# EAGLE schematic EMSBUS (EAGLE 9.6.2)
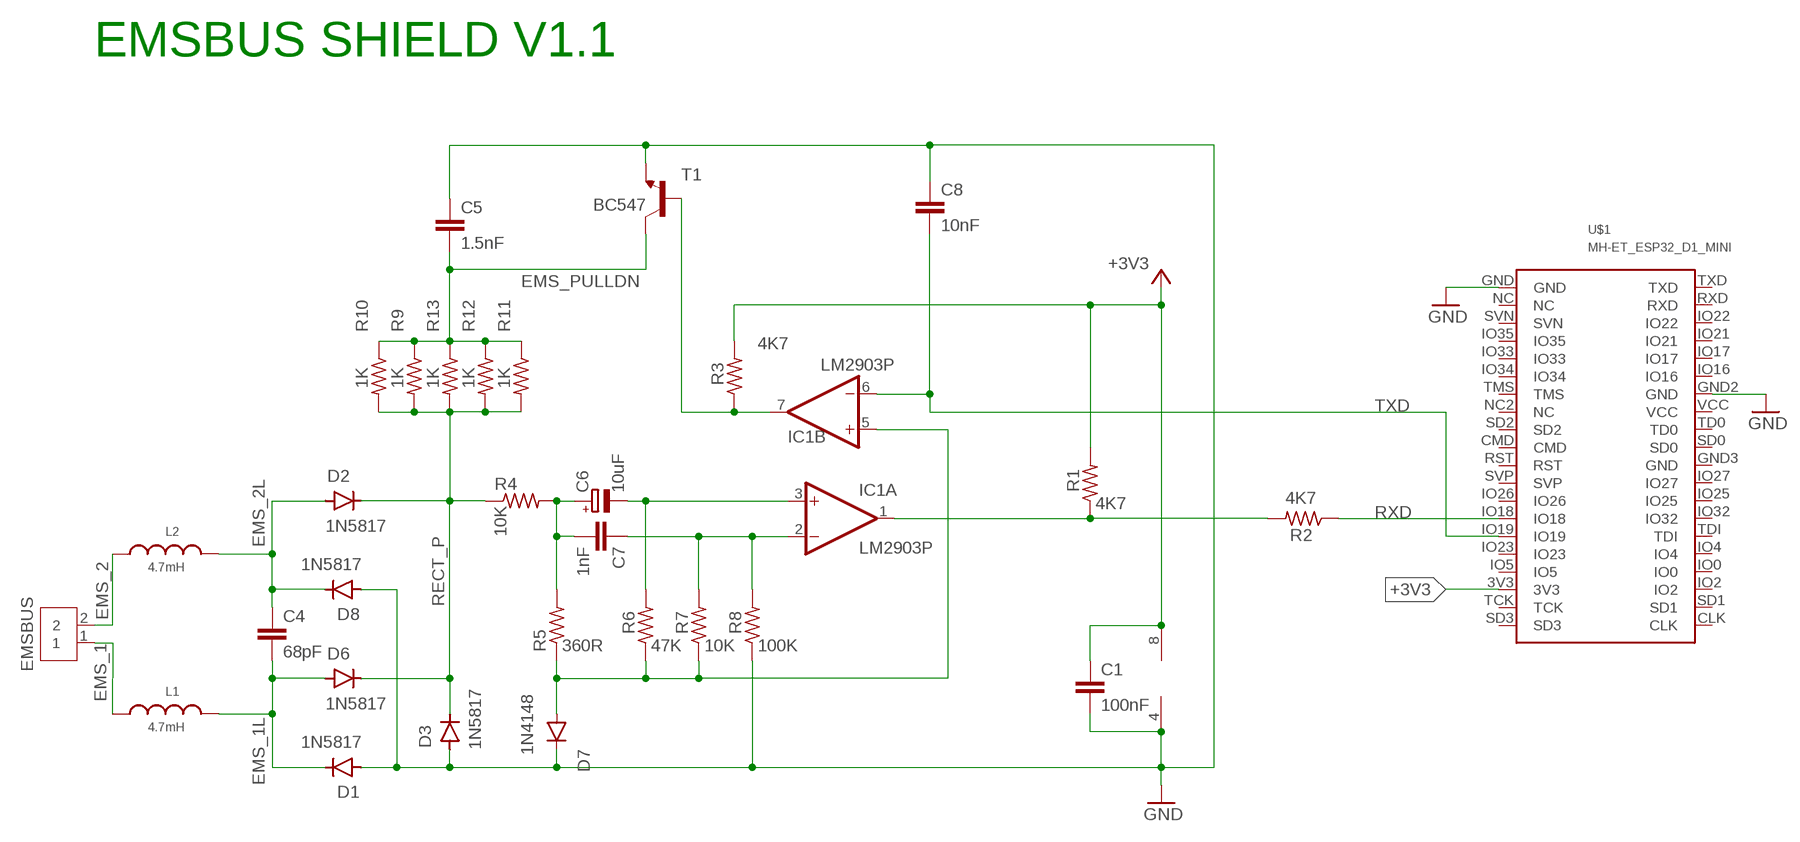
[diagram p0: schematic, sheet 1]

## Parts
C1  100nF  22PF-PTH-2.54MM-200V-5%  [CAP-PTH-2.54]
C4  68pF  22PF-PTH-2.54MM-200V-5%  [CAP-PTH-2.54]
C5  1.5nF  22PF-PTH-2.54MM-200V-5%  [CAP-PTH-2.54]
C6  10uF  CPOL-EUE5-8.5  [E5-8,5]
C7  1nF  22PF-PTH-2.54MM-200V-5%  [CAP-PTH-2.54]
C8  10nF  22PF-PTH-2.54MM-200V-5%  [CAP-PTH-2.54]
D1  1N5817  1N4007  [DO-41]
D2  1N5817  1N4007  [DO-41]
D3  1N5817  1N4007  [DO-41]
D6  1N5817  1N4007  [DO-41]
D7  1N4148  DIODE1N4148  [DIODE-1N4148]
D8  1N5817  1N4007  [DO-41]
EMSBUS  2828XX-2282837-2  [TERMBLK_508-2N]
IC1  LM2903P  TLC393P  [DIL08]
L1  4.7mH  WE-FAMI_744750230030  [WE-FAMI_8010_744750230030]
L2  4.7mH  WE-FAMI_744750230030  [WE-FAMI_8010_744750230030]
R1  4K7  R-US_0204/7  [0204/7]
R2  4K7  R-US_0204/7  [0204/7]
R3  4K7  R-US_0204/7  [0204/7]
R4  10K  R-US_0204/7  [0204/7]
R5  360R  R-US_0204/7  [0204/7]
R6  47K  R-US_0204/7  [0204/7]
R7  10K  R-US_0204/7  [0204/7]
R8  100K  R-US_0204/7  [0204/7]
R9  1K  R-US_0204/7  [0204/7]
R10  1K  R-US_0204/7  [0204/7]
R11  1K  R-US_0204/7  [0204/7]
R12  1K  R-US_0204/7  [0204/7]
R13  1K  R-US_0204/7  [0204/7]
T1  BC547  [TO92]
U$1  MH-ET_ESP32_D1_MINI  [MH-ET_ESP32_D1_MINI]

## Nets
+3V3 [PWR]: C1.1 IC1.8(P:V+) R1.2 R3.2 U$1.3V3
EMS_1 [PWR]: EMSBUS.1 L1.1
EMS_1L [PWR]: C4.2 D1.C D6.A L1.2
EMS_2 [PWR]: EMSBUS.2 L2.1
EMS_2L [PWR]: C4.1 D2.A D8.C L2.2
EMS_PULLDN [PWR]: C5.2 R9.1 R10.1 R11.1 R12.1 R13.1 T1.3(C)
GND [PWR]: C1.2 C5.1 C8.1 D1.A D3.A D7.C D8.A IC1.4(P:V-) R8.1 T1.1(E) U$1.GND U$1.GND2(GND)
N$1: IC1.7(B:OUT) R3.1 T1.2(B)
N$3: IC1.1(A:OUT) R1.1 R2.2
N$5: D7.A IC1.5(B:+IN) R5.1 R6.1 R7.1
N$6: C6.+ C7.2 R4.2 R5.2
N$7: C7.1 IC1.2(A:-IN) R7.2 R8.2
N$8: C6.- IC1.3(A:+IN) R6.2
RECT_P [PWR]: D2.C D3.C D6.C R4.1 R9.2 R10.2 R11.2 R12.2 R13.2
RXD: R2.1 U$1.IO18
TXD: C8.2 IC1.6(B:-IN) U$1.IO19
Unconnected: U$1.CLK U$1.CMD U$1.GND3(GND) U$1.IO0 U$1.IO2 U$1.IO4 U$1.IO5 U$1.IO16 U$1.IO17 U$1.IO21 U$1.IO22 U$1.IO23 U$1.IO25 U$1.IO26 U$1.IO27 U$1.IO32 U$1.IO33 U$1.IO34 U$1.IO35 U$1.NC U$1.NC2(NC) U$1.RST U$1.RXD U$1.SD0 U$1.SD1 U$1.SD2 U$1.SD3 U$1.SVN U$1.SVP U$1.TCK U$1.TD0 U$1.TDI U$1.TMS U$1.TXD U$1.VCC

## Notes on the sheet
- EMSBUS SHIELD V1.1

## Library data of the parts
C1 C4 C5 C7 C8 = SparkFun-Capacitors:22PF: 22pF ceramic capacitors A capacitor is a passive two-terminal electrical component used to store electrical energy temporarily in an electric field.; PROD_ID: CAP-09128; VALUE: 22pF
C6 = resistor:CPOL-EU: POLARIZED CAPACITOR, European symbol
D1-D3 D6 D8 = Diodes:1N4007: DIODE GEN PURP 1KV 1A DO41 Manufacturer's datasheet <https://www.mccsemi.com/pdf/Products/1N4001-1N4007(DO-41).pdf>; CREATED_BY: PCBLayout.com; DIGIKEY_PART_NUMBER: 1N4007MSCT-ND; MANUFACTURER: Micro Commercial Co; MPN: 1N4007; PACKAGE: DO-41
D7 = BeagleBone_Blue_R3:DIODE: Diode These are standard reverse protection diodes and small signal diodes. SMA package can handle up to about 1A. SOD-323 can handle about 200mA. What the SOD-323 package when ordering, there are some mfgs out there that are 5-pin packages.
EMSBUS = Connector:2828XX-2: 2 Position Wire to Board Terminal Block Horizontal with Board Datasheet <https://www.te.com.cn/commerce/DocumentDelivery/DDEController?Action=showdoc&DocId=Catalog+Section%7F1308389_EUROSTYLE_TERMINAL_BLOCKS%7F0607%7Fpdf%7FEnglish%7FENG_CS_1308389_EUROSTYLE_TERMINAL_BLOCKS_0607.pdf%7F2-282837-5>; CATEGORY: Connector; DESCRIPTION: 2 Position Wire to Board Terminal Block Horizontal with Board 5.08 mm Through Hole; MANUFACTURER: TE Connectivity; MPN: 282837-2; OPERATING_TEMPERATURE: -40°C to +105°C; PART_STATUS: ACTIVE; ROHS_COMPLIANCE: RoHS Compliant; SERIES: 282837; SUBCATEGORY: Terminal Block; TYPE: Side Wire Entry
IC1 = linear:TLC393: COMPARATOR; SPICEPREFIX: J
L1 L2 = Wurth_Elektronik_Passive_rev19e:WE-FAMI: WE-FAMI THT Power Inductor Characteristics Optimization of material composition causes high performance Up to 19.7 A Saturation Current RDC values starting at 3.8 mΩ Shielded design Low stray field Application DC/DC converters Power supplies and battery chargers Home Entertainment Systems Portable devices like notebooks <http://katalog.we-online.de/media/images/v2/Family_WE-FAMI.jpg> Details see: http://katalog.we-online.de/en/pbs/WE-FAMI Updated on 2015-05-21 2015(C) Wurth Elektronik; WE-NUMBER: 744750230030/3uH
R1-R13 = BeagleBone_Black_Wireless:R-US_: RESISTOR, American symbol
T1 = transistor:BC547: NPN TRANSISTOR
U$1 = MH-ET_ESP32_D1_MINI:MH-ET_ESP32_D1_MINI

## Net classes
0 default: width 0.813 mm, drill 0.61 mm, clearance 0.406 mm
1 PWR: width 1.219 mm, drill 0.61 mm, clearance 0.406 mm
3 GND: width 1.27 mm
4 3V3: width 1.27 mm